# Altium project AutonomousVehicle_CurrentMeasure.PrjPcb
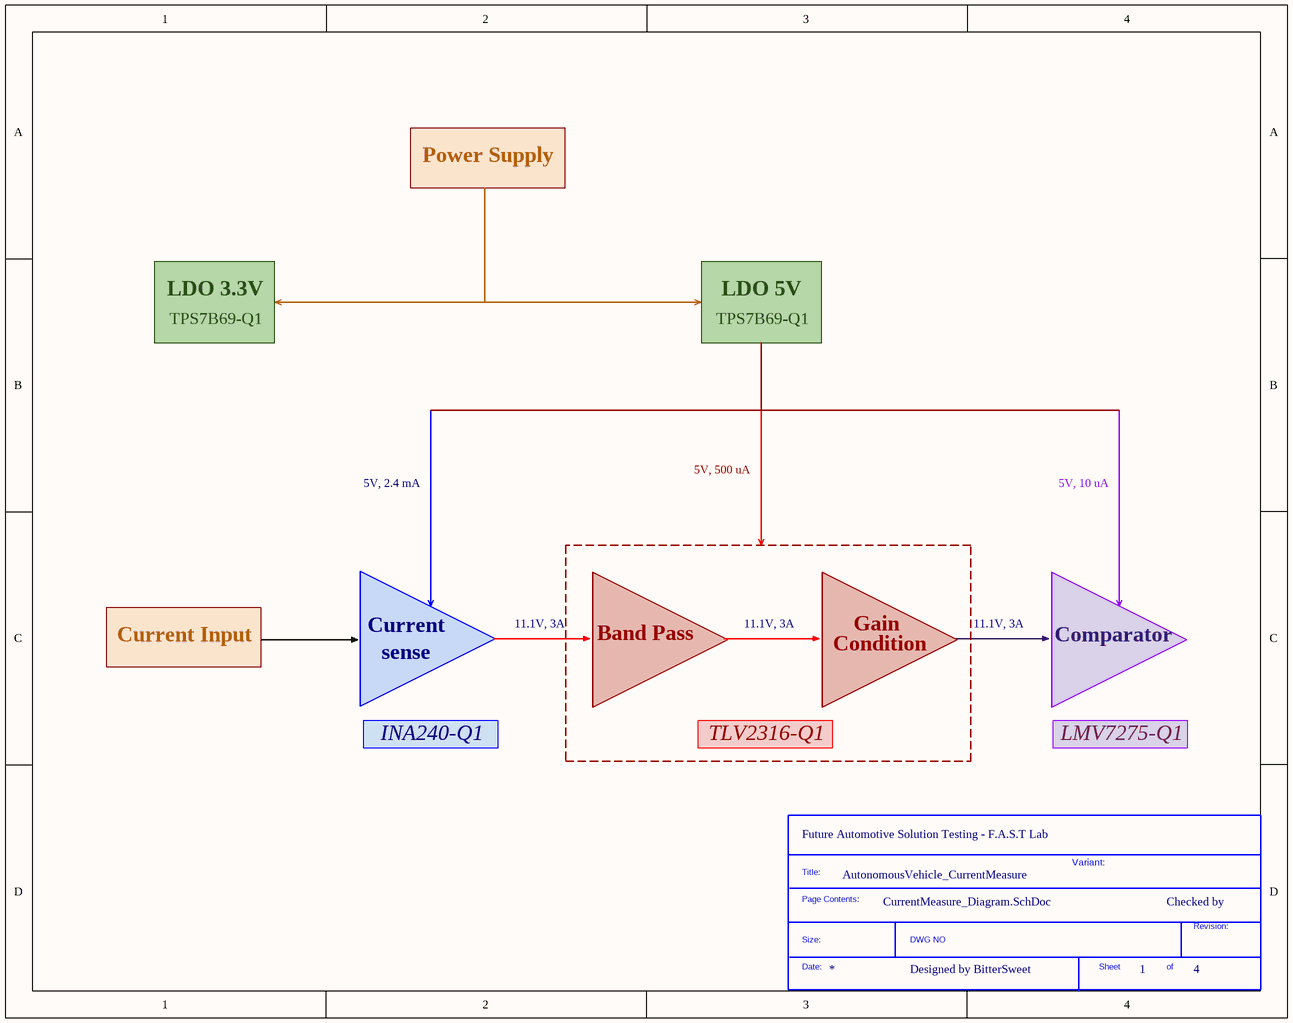
[diagram p0: CurrentMeasure_Diagram.SchDoc]
5 sheets, 79 parts. Net scope: flat (ports and power ports of the same name join across sheets).
Board file: AutonomousVehicle_CurrentMeasure.PcbDoc
Sheets:
  CurrentMeasure_Diagram.SchDoc
  CurrentMeasure_FileInfo.SchDoc
  CurrentMeasure_PowerDistribution.SchDoc
  CurrentMeasure_InputProcessing.SchDoc
  CurrentMeasure_ADCVoltage.SchDoc

## Sheet CurrentMeasure_Diagram.SchDoc
size A; SheetNumber: 1; SheetTotal: 4

### Parts
(Parts that share a designator on the sheet are numbered #1, #2 ... from top to bottom, then left to right.)
*?#1  SDTitleBlock  (value not drawn)  (graphical)

### Notes on the sheet
- Power Supply
- LDO 3.3V
- LDO 5V
- TPS7B69-Q1
- 5V, 2.4 mA
- 5V, 500 uA
- 5V, 10 uA
- Current
- 11.1V, 3A
- Band Pass
- Gain
- Current Input
- sense
- Condition
- Comparator
- INA240-Q1
- TLV2316-Q1
- LMV7275-Q1
- (near *?#1) Future Automotive Solution Testing - F.A.S.T Lab
- AutonomousVehicle_CurrentMeasure
- Variant:
- Checked by
- Designed by BitterSweet
- (in symbol SDTitleBlock) Title:; Page Contents:; Revision:; Size:; DWG NO; Date:; Sheet; of

## Sheet CurrentMeasure_FileInfo.SchDoc
size A; SheetNumber: 2; SheetTotal: 3
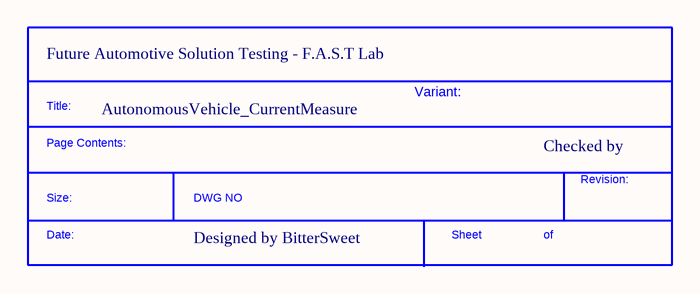
[diagram p1: CurrentMeasure_FileInfo.SchDoc]

### Parts
(Parts that share a designator on the sheet are numbered #1, #2 ... from top to bottom, then left to right.)
*?#2  SDTitleBlock  (value not drawn)  (graphical)

### Notes on the sheet
- (near *?#2) Future Automotive Solution Testing - F.A.S.T Lab
- AutonomousVehicle_CurrentMeasure
- Variant:
- Checked by
- Designed by BitterSweet
- (in symbol SDTitleBlock) Title:; Page Contents:; Revision:; Size:; DWG NO; Date:; Sheet; of

## Sheet CurrentMeasure_PowerDistribution.SchDoc
size A; SheetNumber: 3; SheetTotal: 5
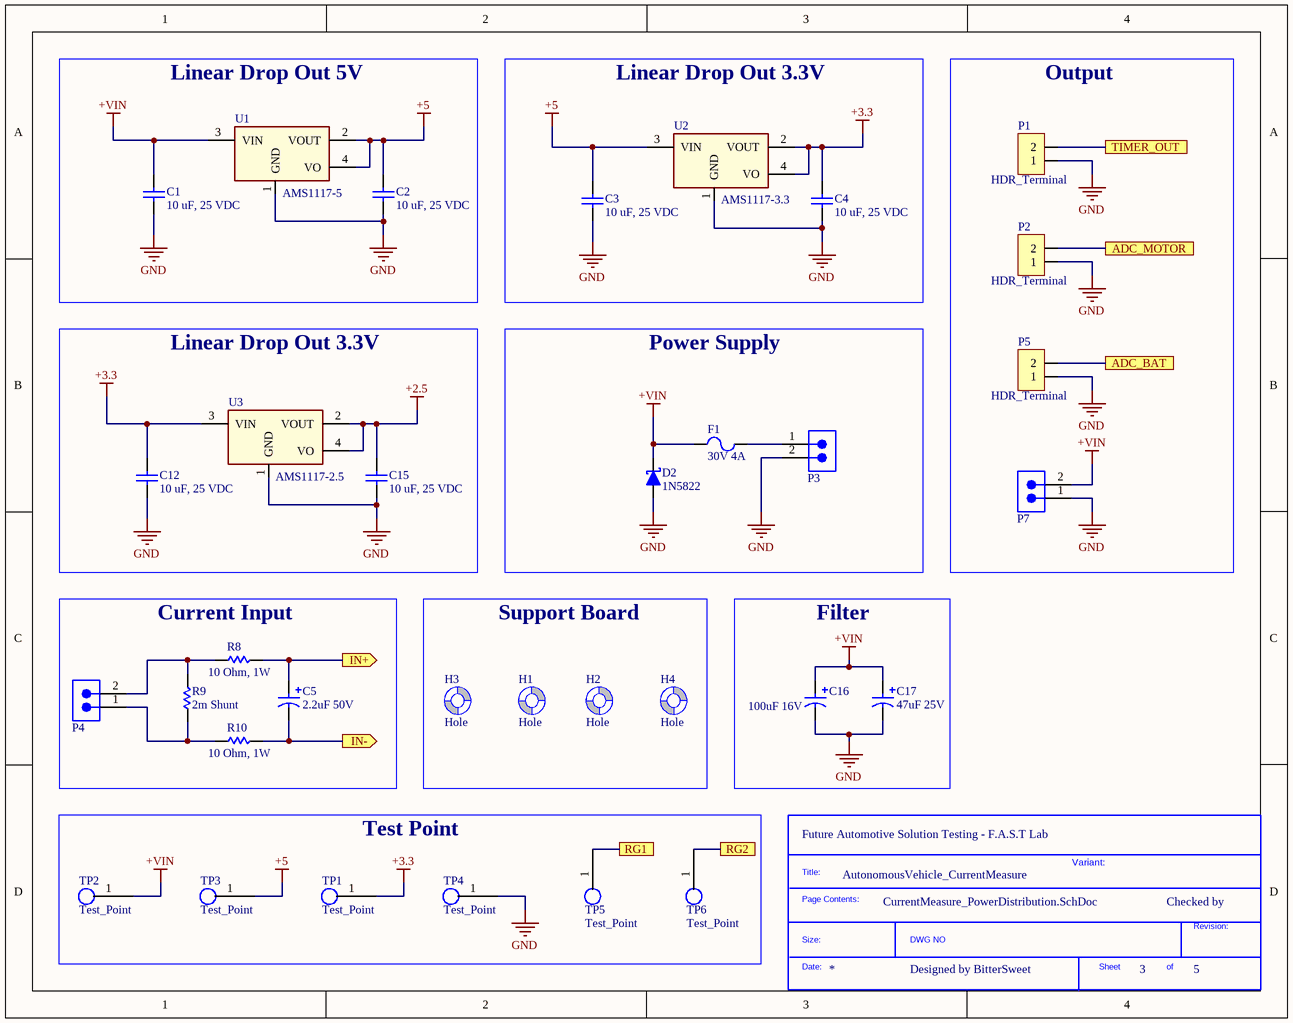
[diagram p2: CurrentMeasure_PowerDistribution.SchDoc]

### Parts
(Parts that share a designator on the sheet are numbered #1, #2 ... from top to bottom, then left to right.)
*?#3  SDTitleBlock  (value not drawn)  (graphical)
C1  10 uF, 25 VDC  [CAP_0805]
C2  10 uF, 25 VDC  [CAP_0805]
C3  10 uF, 25 VDC  [CAP_0805]
C4  10 uF, 25 VDC  [CAP_0805]
C5  2.2uF 50V  [CAP_4x7mm]
C12  10 uF, 25 VDC  [CAP_0805]
C15  10 uF, 25 VDC  [CAP_0805]
C16  100uF 16V  [CAP_4x7mm]
C17  47uF 25V  [CAP_4x7mm]
D2  1N5822  [DIODE_SCHOTTKY_DO-201AD]
F1  30V 4A  [FUSERUEF400]
H1  Hole  [Hole_3.2mm]
H2  Hole  [Hole_3.2mm]
H3  Hole  [Hole_3.2mm]
H4  Hole  [Hole_3.2mm]
P1  HDR_Terminal  [HDR_Header_2.54]
P2  HDR_Terminal  [HDR_Header_2.54]
P3  10A, 300V  [691322310002]  (value not drawn)
P4  10A, 300V  [691322310002]  (value not drawn)
P5  HDR_Terminal  [HDR_Header_2.54]
P7  10A, 300V  [691322310002]  (value not drawn)
R8  10 Ohm, 1W  [RESISTOR-1W]
R9  2m Shunt  [Shunt_Resistor]
R10  10 Ohm, 1W  [RESISTOR-1W]
TP1  Test_Point  [TP_1_5mm_SMD]
TP2  Test_Point  [TP_1_5mm_SMD]
TP3  Test_Point  [TP_1_5mm_SMD]
TP4  Test_Point  [TP_1_5mm_SMD]
TP5  Test_Point  [TP_1_5mm_SMD]
TP6  Test_Point  [TP_1_5mm_SMD]
U1  AMS1117-5  [AMS1117]
U2  AMS1117-3.3  [AMS1117]
U3  AMS1117-2.5  [AMS1117]

### Blocks framed on the sheet
Linear Drop Out 5V: C1 C2 U1
Linear Drop Out 3.3V: C3 C4 U2
Output: P1 P2 P5 P7
Linear Drop Out 3.3V: C12 C15 U3
Power Supply: D2 F1 P3
Current Input: C5 P4 R8-R10
Support Board: H1-H4
Filter: C16 C17
Test Point: TP1-TP6

### Ports
ADC_BAT, ADC_MOTOR, IN+ (out), IN- (out), RG1, RG2, TIMER_OUT

### Nets
+2.5: C15.2 U3.2(VOUT) U3.4(VO)
+3.3: C4.2 C12.2 TP1.1 U2.2(VOUT) U2.4(VO) U3.3(VIN)
+5: C2.2 C3.2 TP3.1 U1.2(VOUT) U1.4(VO) U2.3(VIN)
+VIN: C1.2 C16.2 C17.2 D2.2(K) F1.2 P7.2 TP2.1 U1.3(VIN)
GND: C1.1 C2.1 C3.1 C4.1 C12.1 C15.1 C16.1 C17.1 D2.1(A) P1.1 P2.1 P3.2 P5.1 P7.1 TP4.1 U1.1(GND) U2.1(GND) U3.1(GND)
NetC5_1: C5.1 R10.2 ; port IN-
NetC5_2: C5.2 R8.2 ; port IN+
NetC19_1: P2.2 ; port ADC_MOTOR
NetD3_2: P5.2 ; port ADC_BAT
NetF1_1: F1.1 P3.1
NetP1_2: P1.2 ; port TIMER_OUT
NetP4_1: P4.1 R9.1 R10.1
NetP4_2: P4.2 R8.1 R9.2
NetTP5_1: TP5.1 ; port RG1
NetTP6_1: TP6.1 ; port RG2

Not connected (* = marked no-connect by the designer): H1 1(Screw); H2 1(Screw); H3 1(Screw); H4 1(Screw)

### Notes on the sheet
- (near *?#3) Future Automotive Solution Testing - F.A.S.T Lab
- AutonomousVehicle_CurrentMeasure
- Variant:
- Checked by
- Designed by BitterSweet
- (in symbol SDTitleBlock) Title:; Page Contents:; Revision:; Size:; DWG NO; Date:; Sheet; of

### Library data of the parts
C1-C4 C12 C15 = 0108051061025: CAP, size 0805, 10 uF, 25 VDC; Manufacture Name: TDK; Manufacture SN: CGA4J1X7S1E106K125AE; Capacitance: 10 uF; Tolerance: +/-10%; Voltage Rating DC: 25 VDC; ComponentLink2Description: Datasheet; ComponentLink2URL: https://product.tdk.com/system/files/dam/doc/product/capacitor/ceramic/mlcc/catalog/mlcc_automotive_soft_en.pdf?ref_disty=mouser; Operating Temperature: -55 to +125degC; Packaging: Tape and Reel; Mounting Technology: SMT; Size: 0805; Supplier 1 Name: Mouser; Supplier 1 SN: 810-CGA4J1X7S1E106K2; Supplier 1 URL: https://www.mouser.vn/ProductDetail/TDK/CGA4J1X7S1E106K125AE?qs=PqoDHHvF64%252BJvhmUzM2odA%3D%3D&utm_source=mouser-refine-download&utm_medium=file&utm_campaign=CGA4J1X7S1E106K125AE&utm_content=TDK; Supplier 2 Name: Digi-Key; Supplier 2 SN: 445-181411-2-ND; Supplier 2 URL: https://www.digikey.com/en/products/detail/tdk-corporation/cga4j1x7s1e106k125ae/9744777; Supplier 3 Name: thegioiic; Supplier 3 SN: OEM; Supplier 3 URL: https://www.thegioiic.com/tu-gom-0603-10uf-25v; Value: 10 uF, 25 VDC
C5 = CAPCITOR_POLE: Capacitor D4xL7 2.2uF 50V; URL: https://www.thegioiic.com/tu-hoa-2-2uf-50v-4x7mm-xuyen-lo
C16 = CAPCITOR_POLE: Capacitor D4xL7 100uF 16V; URL: https://www.thegioiic.com/tu-hoa-100uf-16v-5x11mm-xuyen-lo
C17 = CAPCITOR_POLE: Capacitor D4xL7 47uF 25V; URL: https://www.thegioiic.com/tu-hoa-47uf-25v-5x11mm-xuyen-lo
D2 = Diode_Schottky: SS54 SMC Diode Schottky 5A 40V; URL: https://www.thegioiic.com/1n5822-diode-schottky-40v-3a-do-201ad
F1 = Fuse: JLCPCB Part: *; URL: https://www.thegioiic.com/ruef400-cau-chi-tu-phuc-hoi-30v-4a
P1 P2 P5 = HDR_Terminal: HDR_Terminal 2 pin; Supplier: ThegioiIC; ComponentLink1Description: URL; ComponentLink1URL: https://www.thegioiic.com/kf128-2-v-domino-2-chan-thang-3-5mm-300v-10a-han-pcb
P3 P4 P7 = 691322310002: WR-TBL Series 322 Horizontal PCB Header, THT, pitch 3.81mm, 2p; Manufacturer: Wurth Elektronik; Modularity: No; ComponentLink1Description: Datasheet Link; ComponentLink1URL: https://www.we-online.com/redexpert/spec/691322310002?ad; ComponentLink2Description: Supplier 1 URL; ComponentLink2URL: N/A; Manufacturer Part Number: 691322310002; Category: Terminal Blocks; Match Code: WR-TBL; Mount: Through Hole; Operating Temperature Max: 105°C; Operating Temperature Min: -40°C; Packaging: Box; Application: Pluggable; Number of Pins: 2; Number of Rows: 1; Orientation: Horizontal; Pitch: 3.81mm; Rated Current: 10A; Working Voltage: 300V; ComponentLink3Description: Supplier 2 URL; ComponentLink3URL: N/A; ComponentLink4Description: Supplier 3 URL; ComponentLink4URL: https://www.thegioiic.com/kf-3-81-2-r-terminal-block-plug-in-han-pcb-2-chan-cong-3-81mm-300v-10a; Supplier 1 Name: Mouser; Supplier 1 SN: N/A; Supplier 1 URL: N/A; Supplier 2 Name: Digi-Key; Supplier 2 SN: N/A; Supplier 2 URL: N/A; Supplier 3 Name: thegioiic; Supplier 3 SN: N/A; Supplier 3 URL: https://www.thegioiic.com/kf-3-81-2-r-terminal-block-plug-in-han-pcb-2-chan-cong-3-81mm-300v-10a; Value: 10A, 300V
R8 R10 = RESISTOR: Resistor 10 Ohm 1W 1%; MP: NUCLEO-F401RE; Availability: Unavailable; Price: None; Package: None; Value: *; URL: https://www.thegioiic.com/dien-tro-10-ohm-1w-1-5-vong-mau
R9 = RESISTOR: Resistor 2m Ohm Shunt; MP: NUCLEO-F401RE; Availability: Unavailable; Price: None; Package: None; Value: *; ComponentLink1Description: URL; ComponentLink1URL: https://icdayroi.com/dien-tro-shunt-0-002r-2mr
U1-U3 = AMS1117: IC Linear Drop Out 3.3V 1A SOT-223
  U1: URL: https://www.thegioiic.com/xblw-ams1117-5-0v-ic-on-ap-5v-1a-sot-223
  U2: URL: https://www.thegioiic.com/ams1117-3-3v-ic-on-ap-3-3v-1a-sot-223
  U3: URL: https://www.thegioiic.com/ams1117-2-5v-ic-on-ap-2-5v-1a-sot-223

## Sheet CurrentMeasure_InputProcessing.SchDoc
size A; SheetNumber: 4; SheetTotal: 5
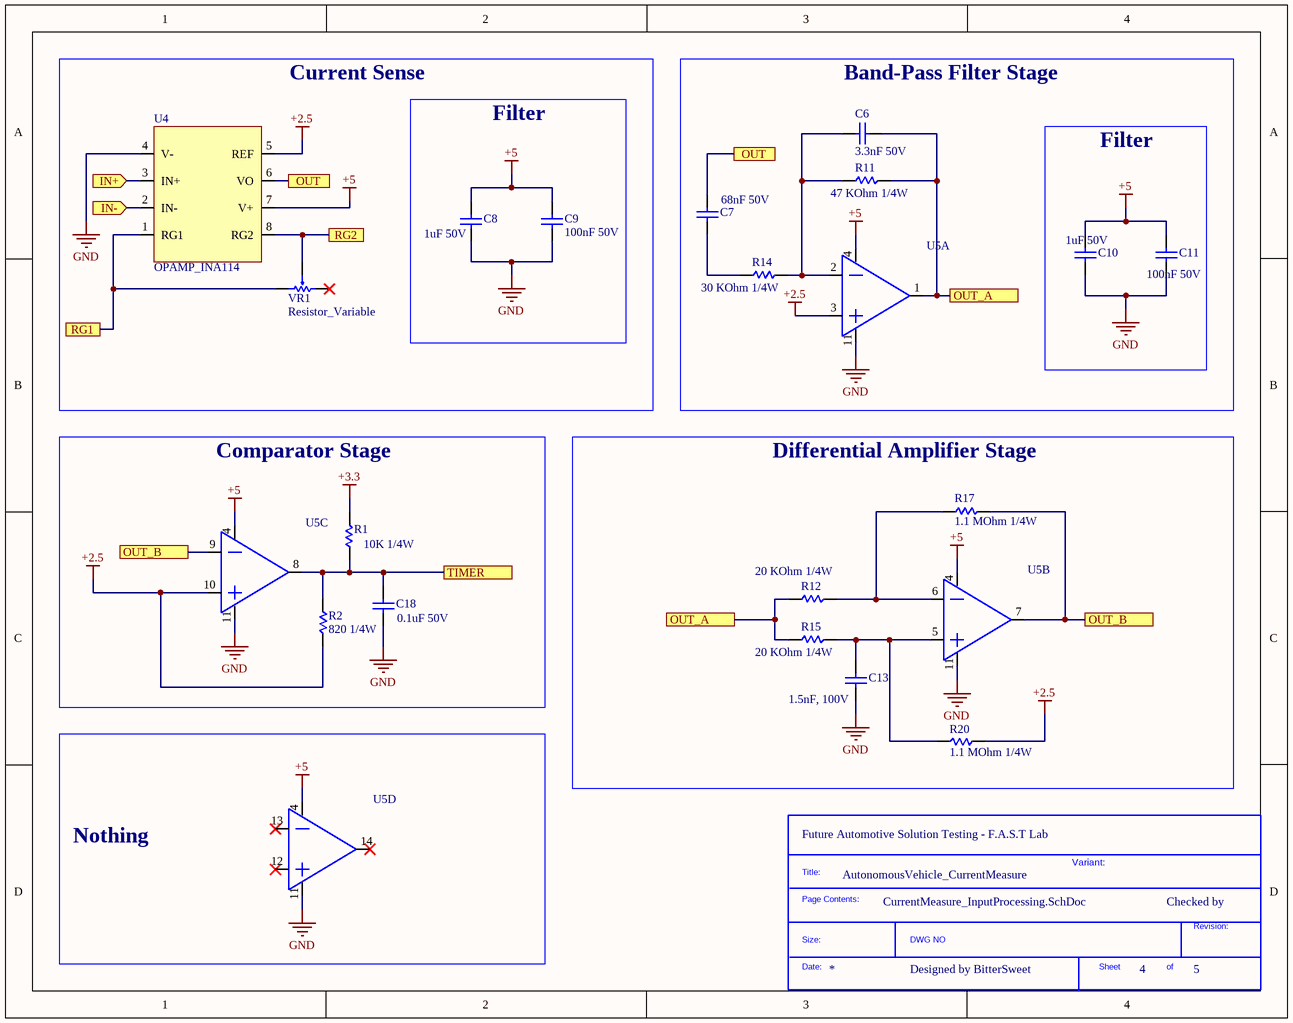
[diagram p3: CurrentMeasure_InputProcessing.SchDoc]

### Parts
(Parts that share a designator on the sheet are numbered #1, #2 ... from top to bottom, then left to right.)
*?#4  SDTitleBlock  (value not drawn)  (graphical)
C6  3.3nF 50V  [CAP_RADIAL_2.54]
C7  68nF 50V  [CAP_RADIAL_2.54]
C8  1uF 50V  [CAP_RADIAL_2.54]
C9  100nF 50V  [CAP_RADIAL_2.54]
C10  1uF 50V  [CAP_RADIAL_2.54]
C11  100nF 50V  [CAP_RADIAL_2.54]
C13  1.5nF, 100V  [Mica_CAP]
C18  0.1uF 50V  [CAP_RADIAL_2.54]
R1  10K 1/4W  [RESISTOR-1/4W]
R2  820 1/4W  [RESISTOR-1/4W]
R11  47 KOhm 1/4W  [RESISTOR-1/4W]
R12  20 KOhm 1/4W  [RESISTOR-1/4W]
R14  30 KOhm 1/4W  [RESISTOR-1/4W]
R15  20 KOhm 1/4W  [RESISTOR-1/4W]
R17  1.1 MOhm 1/4W  [RESISTOR-1/4W]
R20  1.1 MOhm 1/4W  [RESISTOR-1/4W]
U4  OPAMP_INA114  [INA114AP]
U5  IC_OPAMP_LM324N  [LM324_DIP14]  (value not drawn)  (parts A,B,C,D of 4)
VR1  Resistor_Variable  [RESISTOR_VARIABLE]

### Blocks framed on the sheet
Current Sense: U4 VR1
Band-Pass Filter Stage: C6 C7 R11 R14 U5
Filter: C8 C9
Filter: C10 C11
Comparator Stage: C18 R1 R2 U5
Differential Amplifier Stage: C13 R12 R15 R17 R20 U5
Nothing: U5

### Ports
IN+ (in), IN- (in), OUT, OUT_A, OUT_B, RG1, RG2, TIMER

### Nets
+2.5: R2.2 R20.1 U4.5(REF) U5.3(IN1+) U5.10(IN3+)
+3.3: R1.2
+5: C8.1 C9.1 C10.1 C11.1 U4.7(V+) U5.4(VCC)
GND: C8.2 C9.2 C10.2 C11.2 C13.2 C18.1 U4.4(V-) U5.11(GND)
NetC5_1: U4.2(IN-) ; port IN-
NetC5_2: U4.3(IN+) ; port IN+
NetC6_1: C6.1 R11.2 R12.1 R15.1 U5.1(OUT1) ; port OUT_A
NetC6_2: C6.2 R11.1 R14.2 U5.2(IN1-)
NetC7_1: C7.1 R14.1
NetC7_2: C7.2 U4.6(VO) ; port OUT
NetC13_1: C13.1 R15.2 R20.2 U5.5(IN2+)
NetC18_2: C18.2 R1.1 R2.1 U5.8(OUT3) ; port TIMER
NetP6_7: R17.2 U5.7(OUT2) U5.9(IN3-) ; port OUT_B
NetR12_2: R12.2 R17.1 U5.6(IN2-)
NetTP5_1: U4.1(RG1) VR1.1 ; port RG1
NetTP6_1: U4.8(RG2) VR1.2 ; port RG2

Not connected (* = marked no-connect by the designer): U5 12(IN4+)* 13(IN4-)* 14(OUT4)*; VR1 3*

### Notes on the sheet
- (near *?#4) Future Automotive Solution Testing - F.A.S.T Lab
- AutonomousVehicle_CurrentMeasure
- Variant:
- Checked by
- Designed by BitterSweet
- (in symbol SDTitleBlock) Title:; Page Contents:; Revision:; Size:; DWG NO; Date:; Sheet; of

### Library data of the parts
C6 = Capacitor: Capacitor, 3.3nF 50V; URL: https://www.thegioiic.com/tu-gom-tron-3-3nf-50v
C7 = Capacitor: Capacitor, 68nF 50V; URL: https://www.thegioiic.com/tu-gom-tron-68nf-50v
C8 C10 = Capacitor: Capacitor 1uF 50V; URL: https://www.thegioiic.com/tu-gom-multilayer-1uf-50v
C9 C11 = Capacitor: Capacitor 100nF 50V; URL: https://www.thegioiic.com/tu-gom-tron-100nf-0-1uf-50v
C13 = Capacitor
C18 = Capacitor: Capacitor, 0.1uF 50V; URL: https://www.thegioiic.com/tu-gom-tron-100nf-0-1uf-50v
R1 = RESISTOR: Resistor 10 KOhm 1/4W; MP: NUCLEO-F401RE; Availability: Unavailable; Price: None; Package: None; Value: *; ComponentLink1Description: URL; ComponentLink1URL: https://www.thegioiic.com/dien-tro-10-kohm-1-4w-1-5-vong-mau
R2 = RESISTOR: Resistor 820 Ohm 1/4W; MP: NUCLEO-F401RE; Availability: Unavailable; Price: None; Package: None; Value: *; ComponentLink1Description: URL; ComponentLink1URL: https://www.thegioiic.com/dien-tro-820-ohm-1-4w-1-5-vong-mau
R11 R14 = RESISTOR: MP: NUCLEO-F401RE; Availability: Unavailable; Price: None; Package: None; Value: *
  R11: URL: https://www.thegioiic.com/dien-tro-47-kohm-1-4w-1-5-vong-mau
  R14: URL: https://www.thegioiic.com/dien-tro-30-kohm-1-4w-1-5-vong-mau
R12 R15 = RESISTOR: Resistor 20 KOhm 1/4W; MP: NUCLEO-F401RE; Availability: Unavailable; Price: None; Package: None; Value: *; ComponentLink1Description: URL; ComponentLink1URL: https://www.thegioiic.com/dien-tro-20-kohm-1-4w-1-5-vong-mau
R17 = RESISTOR: Resistor 1.1 MOhm 1/4W; MP: NUCLEO-F401RE; Availability: Unavailable; Price: None; Package: None; Value: *; ComponentLink1Description: URL; ComponentLink1URL: https://www.thegioiic.com/dien-tro-1-mohm-1-4w-1-5-vong-mau
R20 = RESISTOR: Resistor 1 MOhm 1/4W; MP: NUCLEO-F401RE; Availability: Unavailable; Price: None; Package: None; Value: *; ComponentLink1Description: URL; ComponentLink1URL: https://www.thegioiic.com/dien-tro-1-mohm-1-4w-1-5-vong-mau
U4 = OPAMP_INA114: INA114AP IC Instrumentation Amplifier 1MHZ, 8-DIP; URL: https://www.thegioiic.com/products?search=INA114
U5 = IC_OPAMP_LM324N: LM324N IC OPAMP General Purpose Amplifier 4 Circuit 1.2MHZ ,14-DIP; URL: https://www.thegioiic.com/lm324n-ic-opamp-general-purpose-amplifier-4-circuit-1-2mhz-14-dip
VR1 = Resistor_Variable: Variable Resister, 3 pins, 10 KOhm

## Sheet CurrentMeasure_ADCVoltage.SchDoc
size A; SheetNumber: 5; SheetTotal: 5
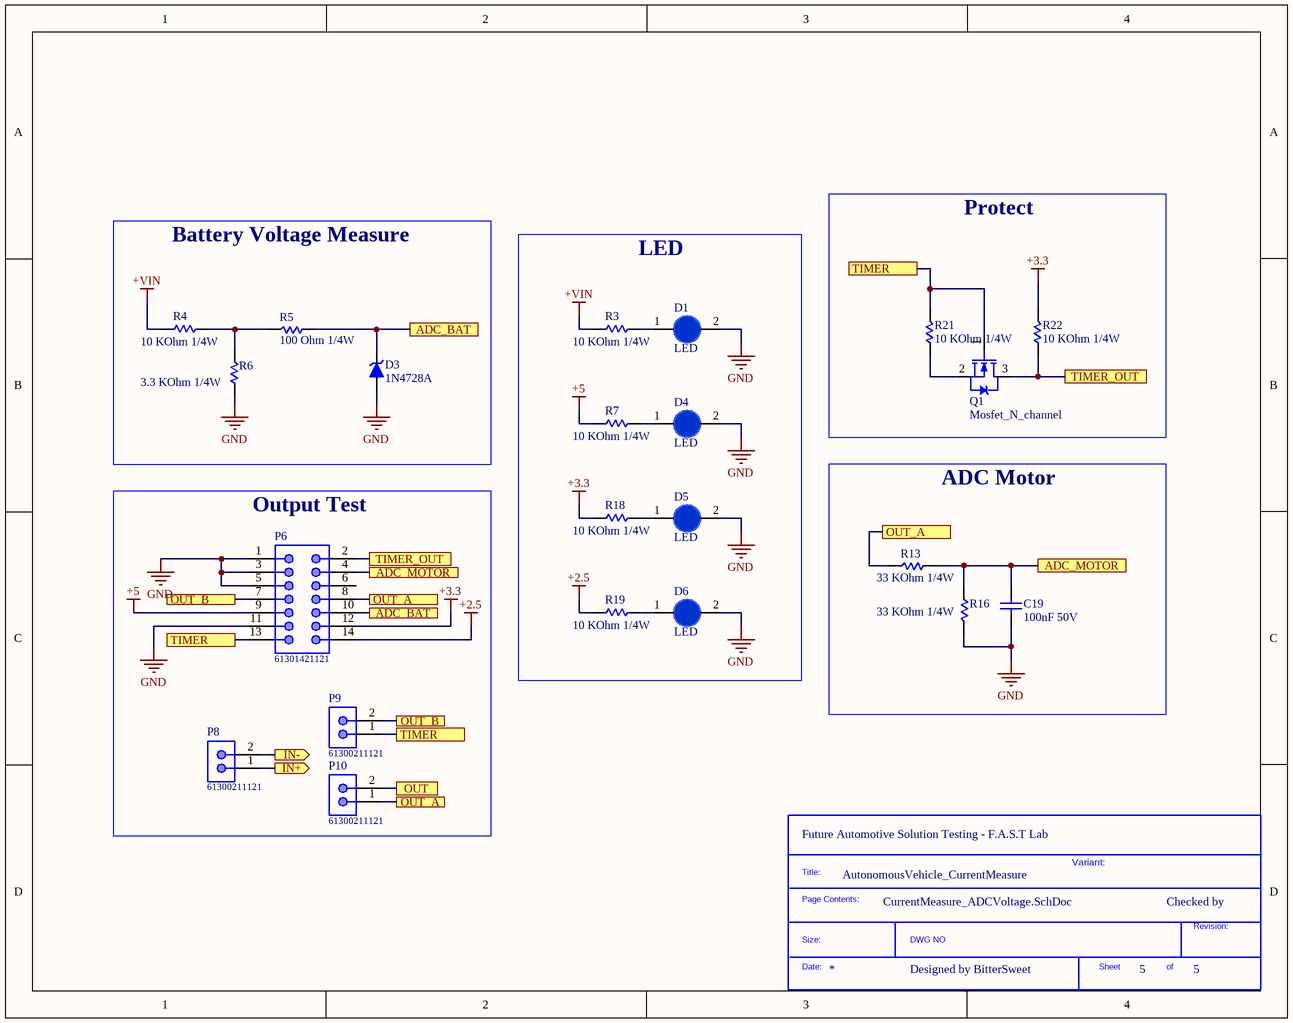
[diagram p4: CurrentMeasure_ADCVoltage.SchDoc]

### Parts
(Parts that share a designator on the sheet are numbered #1, #2 ... from top to bottom, then left to right.)
*?#5  SDTitleBlock  (value not drawn)  (graphical)
C19  100nF 50V  [CAP_RADIAL_2.54]
D1  LED  [DIP_LED_3MM]
D3  1N4728A  [1N4728A_HoleDO-41]
D4  LED  [DIP_LED_3MM]
D5  LED  [DIP_LED_3MM]
D6  LED  [DIP_LED_3MM]
P6  61301421121  [61301421121]
P8  61300211121  [61300211121]
P9  61300211121  [61300211121]
P10  61300211121  [61300211121]
Q1  Mosfet_N_channel  [TO-92]
R3  10 KOhm 1/4W  [RESISTOR-1/4W]
R4  10 KOhm 1/4W  [RESISTOR-1/4W]
R5  100 Ohm 1/4W  [RESISTOR-1/4W]
R6  3.3 KOhm 1/4W  [RESISTOR-1/4W]
R7  10 KOhm 1/4W  [RESISTOR-1/4W]
R13  33 KOhm 1/4W  [RESISTOR-1/4W]
R16  33 KOhm 1/4W  [RESISTOR-1/4W]
R18  10 KOhm 1/4W  [RESISTOR-1/4W]
R19  10 KOhm 1/4W  [RESISTOR-1/4W]
R21  10 KOhm 1/4W  [RESISTOR-1/4W]
R22  10 KOhm 1/4W  [RESISTOR-1/4W]

### Blocks framed on the sheet
Battery Voltage Measure: D3 R4-R6
Protect: Q1 R21 R22
LED: D1 D4-D6 R3 R7 R18 R19
Output Test: P6 P8-P10
ADC Motor: C19 R13 R16

### Ports
ADC_BAT, ADC_MOTOR, IN+ (out), IN- (out), OUT, OUT_A, OUT_B, TIMER, TIMER_OUT

### Nets
+2.5: P6.14 R19.1
+3.3: P6.12 R18.1 R22.2
+5: P6.9 R7.1
+VIN: R3.1 R4.1
GND: C19.2 D1.2(K) D3.1(A) D4.2(K) D5.2(K) D6.2(K) P6.1 P6.3 P6.5 P6.11 R6.1 R16.2
NetC5_1: P8.2 ; port IN-
NetC5_2: P8.1 ; port IN+
NetC6_1: P6.8 P10.1 R13.2 ; port OUT_A
NetC7_2: P10.2 ; port OUT
NetC18_2: P6.13 P9.1 Q1.1(G) R21.2 ; port TIMER
NetC19_1: C19.1 P6.4 R13.1 R16.1 ; port ADC_MOTOR
NetD1_1: D1.1(A) R3.2
NetD3_2: D3.2(K) P6.10 R5.1 ; port ADC_BAT
NetD4_1: D4.1(A) R7.2
NetD5_1: D5.1(A) R18.2
NetD6_1: D6.1(A) R19.2
NetP1_2: P6.2 Q1.3(D) R22.1 ; port TIMER_OUT
NetP6_7: P6.7 P9.2 ; port OUT_B
NetQ1_2: Q1.2(S) R21.1
NetR4_2: R4.2 R5.2 R6.2

Not connected (* = marked no-connect by the designer): P6 6

### Notes on the sheet
- (near *?#5) Future Automotive Solution Testing - F.A.S.T Lab
- AutonomousVehicle_CurrentMeasure
- Variant:
- Checked by
- Designed by BitterSweet
- (in symbol SDTitleBlock) Title:; Page Contents:; Revision:; Size:; DWG NO; Date:; Sheet; of

### Library data of the parts
C19 = Capacitor: Capacitor 100nF 50V; URL: https://www.thegioiic.com/tu-gom-tron-100nf-0-1uf-50v
D1 D4-D6 = LED: DIP LED Blue; URL: https://www.thegioiic.com/led-xanh-duong-3mm-chan-dai
D3 = Diode_Zener: 1N4728A Diode Zener 3.3V 1W  DO-41; URL: https://www.thegioiic.com/1n4728-diode-zener-3-3v-1w
P6 = 61301421121: WR-PHD Pin Header, THT, pitch 2.54mm, Dual Row, Vertical, 14p; Manufacturer: Wurth Elektronik; Pin Number: 14; Rated Current: 3A; Working Voltage: 250VAC; Withstanding Voltage: 500VAC; Contact Resistance: 20mOhm; Supply name 1: Mouser; ComponentLink1Description: Manufacturer; ComponentLink1URL: http://www.we-online.de; ComponentLink2Description: Datasheet; ComponentLink2URL: https://www.we-online.com/catalog/datasheet/61301421121.pdf; Manufacturer Part Number: 61301421121; Published Date: May 2020; Pitch: 2.54mm; Operating Temperature: -40 to +105degC; Mounting Technology: THT; Packaging: Bag; Gender: Pin Header; Row Number: Dual; Orientation: Vertical; ComponentLink3Description: Global Supply; ComponentLink3URL: https://www.we-online.com/en/components/products/PHD_2_54_THT_DUAL_PIN_HEADER_6130XX21121?sq=61301421121#61301421121; ComponentLink4Description: Global Supply; ComponentLink4URL: https://www.mouser.vn/ProductDetail/Wurth-Elektronik/61301421121?qs=PhR8RmCirEb6oOcq3uED2w%3D%3D; Supplier 1 Name: Mouser; Supplier 1 SN: 710-61301421121; Supplier 1 URL: https://www.mouser.vn/ProductDetail/Wurth-Elektronik/61301421121?qs=PhR8RmCirEb6oOcq3uED2w%3D%3D; Supplier 2 Name: Digi-Key; Supplier 2 SN: N/A; Supplier 2 URL: N/A; Supplier 3 Name: thegioiic; Supplier 3 SN: N/A; Supplier 3 URL: N/A
P8-P10 = 61300211121: WR-PHD Pin Header, THT, pitch 2.54mm, Single Row, Vertical, 2p; Manufacturer: Wurth Elektronik; Pin Number: 2; Rated Current: 3A; Working Voltage: 250VAC; Withstanding Voltage: 500VAC; Contact Resistance: 20mOhm; Supply Name 1: Mouser; ComponentLink1Description: Manufacturer; ComponentLink1URL: http://www.we-online.de; ComponentLink2Description: Datasheet; ComponentLink2URL: https://www.we-online.com/catalog/datasheet/61300211121.pdf; Manufacturer Part Number: 61300211121; Published Date: May 2020; Pitch: 2.54mm; Operating Temperature: -40 to +105degC; Mounting Technology: THT; Packaging: Bag; Gender: Pin Header; Row Number: Single; Orientation: Vertical; ComponentLink3Description: Global Supply; ComponentLink3URL: https://www.mouser.vn/ProductDetail/Wurth-Elektronik/61300211121?qs=t4813l51qx%252B1A5GYDQxPlw%3D%3D; Supplier 1 Name: Mouser; Supplier 1 SN: 710-61300211121; Supplier 1 URL: https://www.mouser.vn/ProductDetail/Wurth-Elektronik/61300211121?qs=t4813l51qx%252B1A5GYDQxPlw%3D%3D; Supplier 2 Name: Digi-Key; Supplier 2 SN: N/A; Supplier 2 URL: N/A; Supplier 3 Name: thegioiic; Supplier 3 SN: N/A; Supplier 3 URL: N/A
R3-R7 R13 R16 R18 R19 R21 R22 = RESISTOR: MP: NUCLEO-F401RE; Availability: Unavailable; Price: None; Package: None; Value: *
  R3 R4 R7 R18 R19 R21 R22: URL: https://www.thegioiic.com/dien-tro-10-kohm-1-4w-1-5-vong-mau
  R5: URL: https://www.thegioiic.com/dien-tro-100-ohm-1-4w-1-5-vong-mau
  R6: URL: https://www.thegioiic.com/dien-tro-3-3-kohm-1-4w-1-5-vong-mau
  R13 R16: URL: https://www.thegioiic.com/dien-tro-33-kohm-1-4w-1-5-vong-mau

## Nets that join several sheets
+2.5: CurrentMeasure_PowerDistribution (C15.2 U3.2 U3.4), CurrentMeasure_InputProcessing (5 pins), CurrentMeasure_ADCVoltage (P6.14 R19.1)
+3.3: CurrentMeasure_PowerDistribution (6 pins), CurrentMeasure_InputProcessing (R1.2), CurrentMeasure_ADCVoltage (P6.12 R18.1 R22.2)
+5: CurrentMeasure_PowerDistribution (6 pins), CurrentMeasure_InputProcessing (6 pins), CurrentMeasure_ADCVoltage (P6.9 R7.1)
+VIN: CurrentMeasure_PowerDistribution (8 pins), CurrentMeasure_ADCVoltage (R3.1 R4.1)
GND: CurrentMeasure_PowerDistribution (18 pins), CurrentMeasure_InputProcessing (8 pins), CurrentMeasure_ADCVoltage (12 pins)
NetC5_1: CurrentMeasure_PowerDistribution (C5.1 R10.2), CurrentMeasure_InputProcessing (U4.2), CurrentMeasure_ADCVoltage (P8.2)
NetC5_2: CurrentMeasure_PowerDistribution (C5.2 R8.2), CurrentMeasure_InputProcessing (U4.3), CurrentMeasure_ADCVoltage (P8.1)
NetC6_1: CurrentMeasure_InputProcessing (5 pins), CurrentMeasure_ADCVoltage (P6.8 P10.1 R13.2)
NetC7_2: CurrentMeasure_InputProcessing (C7.2 U4.6), CurrentMeasure_ADCVoltage (P10.2)
NetC18_2: CurrentMeasure_InputProcessing (C18.2 R1.1 R2.1 U5.8), CurrentMeasure_ADCVoltage (P6.13 P9.1 Q1.1 R21.2)
NetC19_1: CurrentMeasure_PowerDistribution (P2.2), CurrentMeasure_ADCVoltage (C19.1 P6.4 R13.1 R16.1)
NetD3_2: CurrentMeasure_PowerDistribution (P5.2), CurrentMeasure_ADCVoltage (D3.2 P6.10 R5.1)
NetP1_2: CurrentMeasure_PowerDistribution (P1.2), CurrentMeasure_ADCVoltage (P6.2 Q1.3 R22.1)
NetP6_7: CurrentMeasure_InputProcessing (R17.2 U5.7 U5.9), CurrentMeasure_ADCVoltage (P6.7 P9.2)
NetTP5_1: CurrentMeasure_PowerDistribution (TP5.1), CurrentMeasure_InputProcessing (U4.1 VR1.1)
NetTP6_1: CurrentMeasure_PowerDistribution (TP6.1), CurrentMeasure_InputProcessing (U4.8 VR1.2)